# EAGLE design saa1064 (EAGLE 5.06)
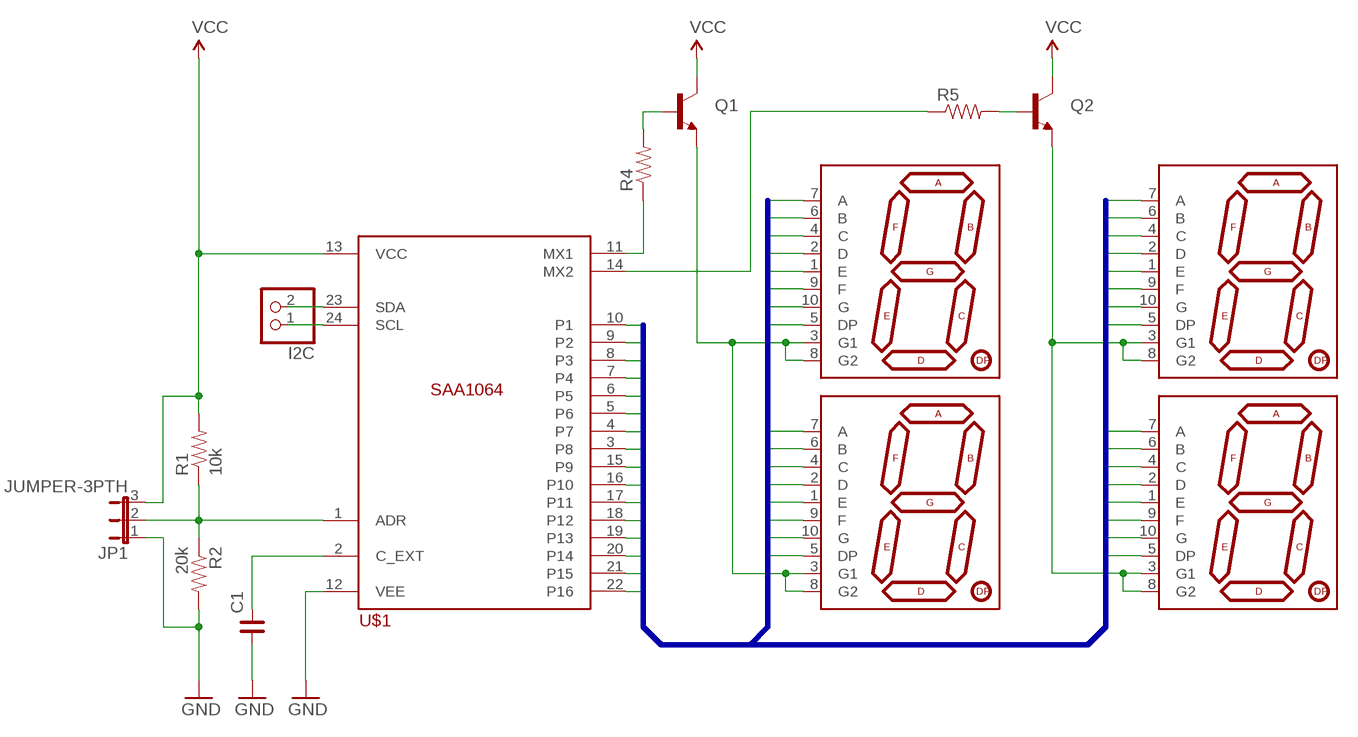
[diagram p0: schematic, sheet 1]

## Parts
C1  C_C020-035X018  [C020-035X018]
I2C  PINHD-1X2  [1X02]
JP1  JUMPER-3PTH  [1X03]
Q1  TRANSISTOR_NPNTO92  [TO-92]
Q2  TRANSISTOR_NPNTO92  [TO-92]
R1  10k  RESISTORPTH1  [AXIAL-0.3]
R2  20k  RESISTORPTH1  [AXIAL-0.3]
R4  RESISTORPTH1  [AXIAL-0.3]
R5  RESISTORPTH1  [AXIAL-0.3]
U$1  SAA1064  [DIL24-6]
U$2  7-SEGMENT-DISPLAYPTH  [7-SEGMENT-DISPLAY]
U$3  7-SEGMENT-DISPLAYPTH  [7-SEGMENT-DISPLAY]
U$5  7-SEGMENT-DISPLAYPTH  [7-SEGMENT-DISPLAY]
U$6  7-SEGMENT-DISPLAYPTH  [7-SEGMENT-DISPLAY]

## Nets
GND: C1.1 JP1.1 R2.P$2 U$1.12(VEE)
N$1: R5.P$1 U$1.14(MX2)
N$2: R4.P$1 U$1.11(MX1)
N$3: Q1.1(E) U$2.3(G1) U$2.8(G2) U$5.3(G1) U$5.8(G2)
N$4: Q2.2(B) R5.P$2
N$5: C1.2 U$1.2(C_EXT)
N$6: Q2.1(E) U$3.3(G1) U$3.8(G2) U$6.3(G1) U$6.8(G2)
N$7: I2C.2 U$1.23(SDA)
N$8: I2C.1 U$1.24(SCL)
N$9: JP1.2 R1.P$1 R2.P$1 U$1.1(ADR)
N$11: Q1.2(B) R4.P$2
OUT1: U$1.10(P1) U$2.7(A) U$6.7(A)
OUT2: U$1.9(P2) U$2.6(B) U$6.6(B)
OUT3: U$1.8(P3) U$2.4(C) U$6.4(C)
OUT4: U$1.7(P4) U$2.2(D) U$6.2(D)
OUT5: U$1.6(P5) U$2.1(E) U$6.1(E)
OUT6: U$1.5(P6) U$2.9(F) U$6.9(F)
OUT7: U$1.4(P7) U$2.10(G) U$6.10(G)
OUT8: U$1.3(P8) U$2.5(DP) U$6.5(DP)
OUT9: U$1.15(P9) U$3.7(A) U$5.7(A)
OUT10: U$1.16(P10) U$3.6(B) U$5.6(B)
OUT11: U$1.17(P11) U$3.4(C) U$5.4(C)
OUT12: U$1.18(P12) U$3.2(D) U$5.2(D)
OUT13: U$1.19(P13) U$3.1(E) U$5.1(E)
OUT14: U$1.20(P14) U$3.9(F) U$5.9(F)
OUT15: U$1.21(P15) U$3.10(G) U$5.10(G)
OUT16: U$1.22(P16) U$3.5(DP) U$5.5(DP)
VCC: JP1.3 Q1.3(C) Q2.3(C) R1.P$2 U$1.13(VCC)

## Buses
OUT[1..16]

## Library data of the parts
C1 = rc-master:C_: NON-POLARIZED CAP
I2C = pinhead:PINHD-1X2: PIN HEADER
JP1 = SparkFun:JUMPER-3
Q1 Q2 = SparkFun:TRANSISTOR_NPN: Transistor NPN BJT configuration in SOT23 package. MMBT2222 is the common NPN we use. Double check BCE configuration again layout.
R1 R2 R4 R5 = SparkFun:RESISTOR: Resistor Basic schematic elements and footprints for 0603, 1206, and PTH 1/10th watt (small) resistors.
U$1 = saa1064:SAA1064: 4-digit LED-driver with I2C-Bus interface
U$2 U$3 U$5 U$6 = SparkFun:7-SEGMENT-DISPLAY

## Board
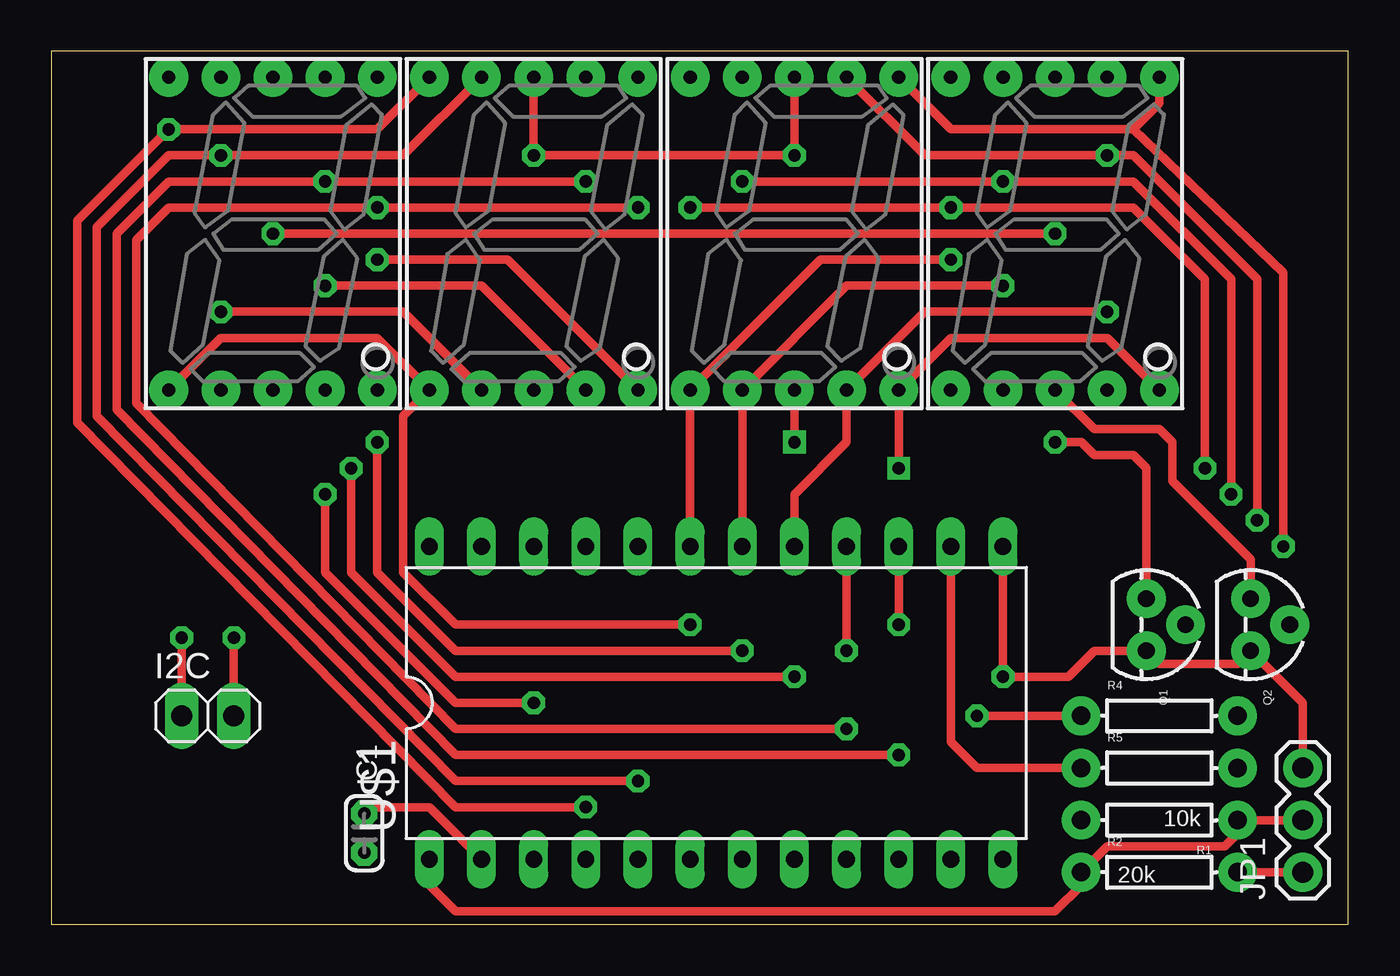
[diagram p1: board, top side]
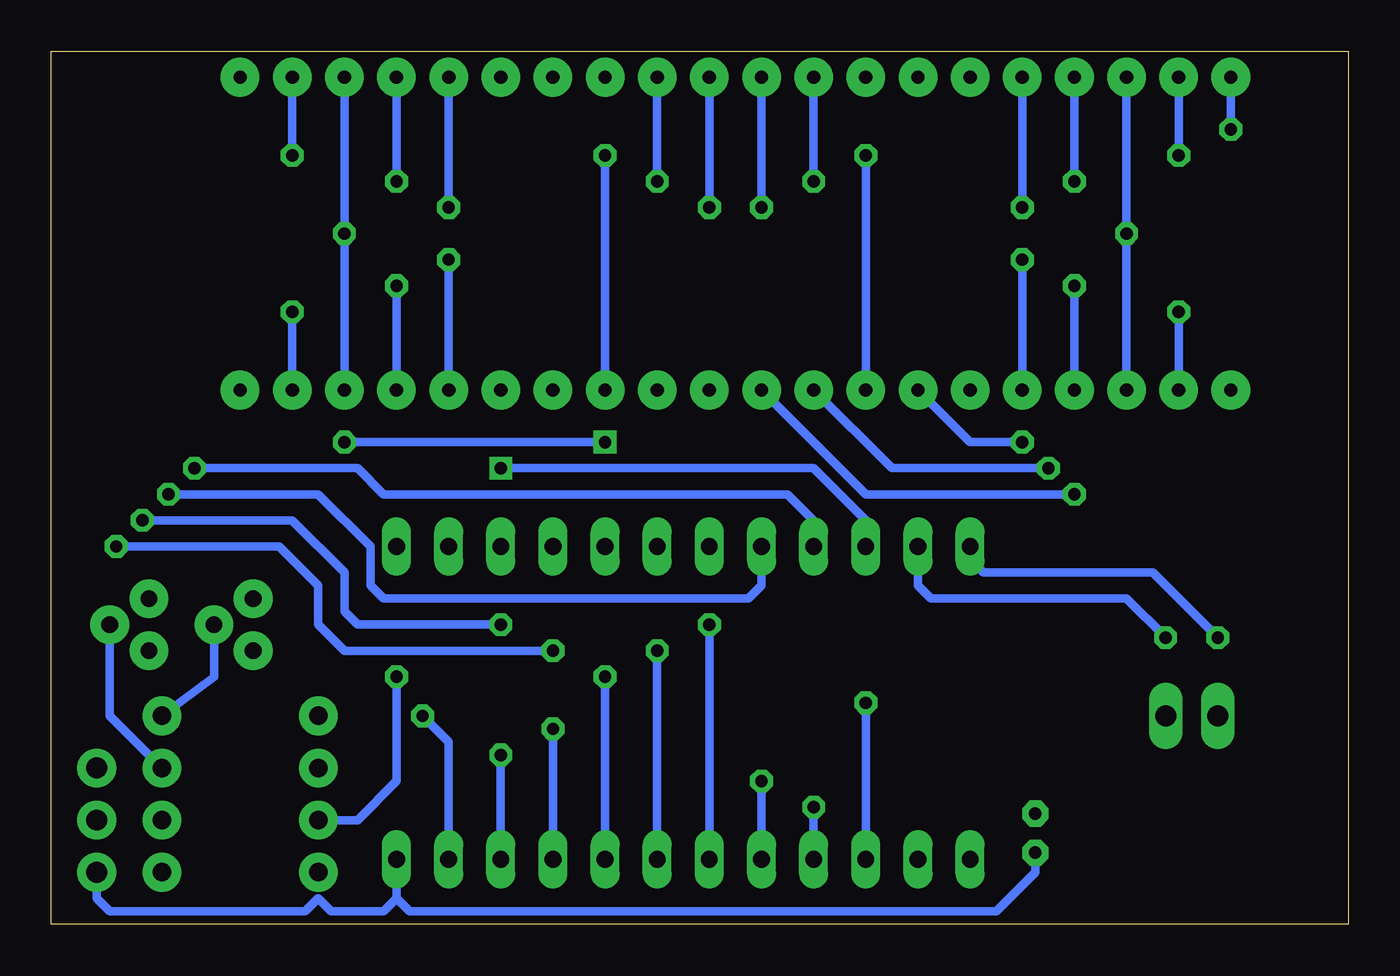
[diagram p2: board, bottom side, seen from below]

Size 63.17 x 42.53 mm. Coordinates in mm from the lower left corner, seen from the top.
Outline: 0,0 63.17,0 63.17,42.53 0,42.53 0,0
Copper layers (1*16): Top 0.035mm / dielectric 1.5mm / Bottom 0.035mm
Design rules "SparkFun": minimum track width 8mil, minimum drill 20mil, track to track 8mil, track to pad 8mil, pad to pad 8mil, via to via 8mil, smd to smd 8mil, copper to edge 10mil, drill to drill 8mil, minimum pad ring 12mil, minimum via ring 10mil, stop-mask expansion 4mil, vias tented up to drill 25mil, thermal gap 10mil

### Footprints (pad centres in the part's own frame; a part is rotated, then mirrored left to right if it is on the bottom)
C020-035X018 = drill 0.61 pad 1.27 octagon: 1 -0.953,0; 2 0.953,0
1X02 = drill 1.016 long: 1 -1.27,0; 2 1.27,0
1X03 = drill 1.016 pad 1.88 round: 1 0,0; 2 2.54,0; 3 5.08,0
TO-92 = drill 0.813 pad 1.88 round: 1 -1.27,0; 2 0,1.905; 3 1.27,0
AXIAL-0.3 = drill 0.9 pad 1.88 round: P$1 -3.81,0; P$2 3.81,0
DIL24-6 = drill 0.813 long: 1 -13.97,-7.62; 2 -11.43,-7.62; 3 -8.89,-7.62; 4 -6.35,-7.62; 5 -3.81,-7.62; 6 -1.27,-7.62; 7 1.27,-7.62; 8 3.81,-7.62; 9 6.35,-7.62; 10 8.89,-7.62; 11 11.43,-7.62; 12 13.97,-7.62; 13 13.97,7.62; 14 11.43,7.62; 15 8.89,7.62; 16 6.35,7.62; 17 3.81,7.62; 18 1.27,7.62; 19 -1.27,7.62; 20 -3.81,7.62; 21 -6.35,7.62; 22 -8.89,7.62; 23 -11.43,7.62; 24 -13.97,7.62
7-SEGMENT-DISPLAY = drill 0.65 pad 1.88 round: 1 -5.08,-7.62; 2 -2.54,-7.62; 3 0,-7.62; 4 2.54,-7.62; 5 5.08,-7.62; 6 5.08,7.62; 7 2.54,7.62; 8 0,7.62; 9 -2.54,7.62; 10 -5.08,7.62

### Placement (x,y rotation side)
C1  15.24,4.45 90 top
I2C  7.62,10.16 0 top
JP1  60.96,2.54 90 top
Q1  53.34,14.61 270 top
Q2  58.42,14.61 270 top
R1  53.98,5.08 180 top
R2  53.98,2.54 0 top
R4  53.98,10.16 0 top
R5  53.98,7.62 0 top
U$1  32.38,10.79 0 top
U$2  23.5,33.66 0 top
U$3  48.9,33.66 0 top
U$5  36.2,33.66 0 top
U$6  10.79,33.66 0 top

### Tracks (layer width: path | path; a pad name or v marks a point on that pad's centre or on a via)
GND
  Top 0.406: JP1.1 R2.P$2
  Bottom 0.406: 46.35,1.27 U$1.12 | 46.35,1.27 45.72,0.64 17.14,0.64 15.24,2.54 C1.1 | 46.35,1.27 46.99,0.64 49.53,0.64 50.16,1.27 50.8,0.64 60.33,0.64 60.96,1.27 JP1.1
N$1
  Top 0.406: U$1.14 43.81,8.89 45.09,7.62 R5.P$1
N$2  (via drill 0.6)
  Top 0.406: v45.09,10.16 R4.P$1
  Bottom 0.406: v45.09,10.16 43.81,8.89 U$1.11
N$3  (via drill 0.6)
  Top 0.406: U$2.8 v23.5,37.47 v36.2,37.47 U$5.8 | U$5.3 v36.2,23.5 | v48.9,23.5 50.16,23.5 50.8,22.86 52.7,22.86 53.34,22.23 Q1.1
  Bottom 0.406: U$2.3 v23.5,37.47 | v36.2,37.47 U$5.3 | v36.2,23.5 v48.9,23.5
N$4
  Bottom 0.406: Q2.2 60.33,10.16 R5.P$2
N$5
  Top 0.406: C1.2 15.88,5.71 18.41,5.71 U$1.2
N$6  (via drill 0.6)
  Top 0.406: v10.79,33.66 v48.9,33.66 | U$3.3 50.8,24.13 53.98,24.13 54.61,23.5 54.61,21.59 58.42,17.78 Q2.1
  Bottom 0.406: U$3.3 v48.9,33.66 U$3.8 | U$6.3 v10.79,33.66 U$6.8
N$7  (via drill 0.6)
  Top 0.406: I2C.2 v8.89,13.97
  Bottom 0.406: U$1.23 20.95,16.51 20.32,15.88 10.79,15.88 v8.89,13.97
N$8  (via drill 0.6)
  Top 0.406: I2C.1 v6.35,13.97
  Bottom 0.406: U$1.24 18.41,17.78 17.78,17.14 9.53,17.14 v6.35,13.97
N$9
  Top 0.406: U$1.1 18.41,1.91 19.68,0.64 48.9,0.64 50.16,1.91 R2.P$1 51.44,3.81 57.15,3.81 57.78,4.45 R1.P$1 JP1.2
N$11
  Bottom 0.406: Q1.2 55.24,12.06 R4.P$2
OUT1  (via drill 0.6)
  Top 0.406: v26.04,36.2 v13.34,36.2 5.71,36.2 3.17,33.66 3.17,25.08 19.68,8.26 v41.27,8.26
  Bottom 0.406: v13.34,36.2 U$6.7 | v26.04,36.2 U$2.7 | v41.27,8.26 U$1.10
OUT2  (via drill 0.6)
  Top 0.406: v28.57,34.92 v15.88,34.92 5.71,34.92 4.13,33.34 4.13,27.3 4.13,25.4 19.68,9.53 v38.73,9.53
  Bottom 0.406: v28.57,34.92 U$2.6 | v15.88,34.92 U$6.6 | v38.73,9.53 U$1.9
OUT3  (via drill 0.6)
  Top 0.406: v13.34,31.11 20.95,31.11 U$2.4 | v14.61,22.23 14.61,17.14 19.68,12.06 v36.2,12.06
  Bottom 0.406: v13.34,31.11 U$6.4 | v36.2,12.06 U$1.8 | v14.61,22.23 22.23,22.23 U$2.4
OUT4  (via drill 0.6)
  Top 0.406: v8.26,29.84 17.14,29.84 U$2.2 | v33.66,13.34 19.68,13.34 15.88,17.14 v15.88,23.5
  Bottom 0.406: v8.26,29.84 U$6.2 | v33.66,13.34 U$1.7 | v15.88,23.5 18.41,23.5 U$2.2
OUT5  (via drill 0.6)
  Top 0.406: v31.11,14.61 19.68,14.61 17.14,17.14 17.14,24.77 U$2.1 15.88,28.57 8.26,28.57 U$6.1
  Bottom 0.406: v31.11,14.61 U$1.6
OUT6  (via drill 0.6)
  Top 0.406: U$2.9 17.14,37.47 v8.26,37.47 5.71,37.47 2.22,33.97 2.22,24.77 19.68,6.99 v28.57,6.99
  Bottom 0.406: v8.26,37.47 U$6.9 | v28.57,6.99 U$1.5
OUT7  (via drill 0.6)
  Top 0.406: U$2.10 15.88,38.73 v5.71,38.73 1.27,34.29 1.27,24.45 19.68,5.71 v26.04,5.71
  Bottom 0.406: v5.71,38.73 U$6.10 | v26.04,5.71 U$1.4
OUT8  (via drill 0.6)
  Top 0.406: v15.88,32.38 22.23,32.38 U$2.5 | v13.34,20.95 13.34,17.14 19.68,10.79 v23.5,10.79
  Bottom 0.406: v15.88,32.38 U$6.5 | U$1.3 v23.5,10.79 | v13.34,20.95 23.5,20.95 U$2.5
OUT9  (via drill 0.6)
  Top 0.406: U$5.7 42.55,37.47 v51.44,37.47 52.7,37.47 58.74,31.43 v58.74,19.68 | v41.27,14.61 U$1.15
  Bottom 0.406: v51.44,37.47 U$3.7 | v41.27,14.61 48.26,14.61 48.9,15.24 48.9,17.14 51.44,19.68 v58.74,19.68
OUT10  (via drill 0.6)
  Top 0.406: 52.7,38.73 60.01,31.75 v60.01,18.41 | 52.7,38.73 53.98,40.01 U$3.6 | U$5.6 43.81,38.73 52.7,38.73 | v38.73,13.34 U$1.16
  Bottom 0.406: v38.73,13.34 48.9,13.34 50.16,14.61 50.16,16.51 52.07,18.41 v60.01,18.41
OUT11  (via drill 0.6)
  Top 0.406: v51.44,29.84 42.55,29.84 U$5.4 38.73,23.5 36.2,20.95 U$1.17
  Bottom 0.406: v51.44,29.84 U$3.4
OUT12  (via drill 0.6)
  Top 0.406: v46.35,31.11 38.73,31.11 U$5.2 U$1.18
  Bottom 0.406: v46.35,31.11 U$3.2
OUT13  (via drill 0.6)
  Top 0.406: v43.81,32.38 37.47,32.38 U$5.1 U$1.19
  Bottom 0.406: v43.81,32.38 U$3.1
OUT14  (via drill 0.6)
  Top 0.406: v33.66,36.2 v46.35,36.2 52.7,36.2 57.47,31.43 v57.47,20.95
  Bottom 0.406: v46.35,36.2 U$3.9 | v33.66,36.2 U$5.9 | U$1.20 28.57,16.51 29.21,15.88 46.99,15.88 47.62,16.51 47.62,18.41 50.16,20.95 v57.47,20.95
OUT15  (via drill 0.6)
  Top 0.406: v31.11,34.92 v43.81,34.92 52.7,34.92 56.2,31.43 v56.2,22.23
  Bottom 0.406: v43.81,34.92 U$3.10 | v31.11,34.92 U$5.10 | U$1.21 26.04,19.68 27.3,20.95 46.99,20.95 48.26,22.23 v56.2,22.23
OUT16  (via drill 0.6)
  Top 0.406: U$3.5 51.44,28.57 43.81,28.57 U$5.5 v41.27,22.23
  Bottom 0.406: v41.27,22.23 26.04,22.23 23.5,19.68 U$1.22
VCC  (via drill 0.6)
  Top 0.406: U$1.13 v46.35,12.06 49.53,12.06 50.8,13.34 Q1.3 53.98,12.7 57.78,12.7 Q2.3 60.96,10.79 JP1.3
  Bottom 0.406: v46.35,12.06 46.35,6.99 48.26,5.08 R1.P$2